# Altium schematic sheet zero cross lm358.SchDoc
size A
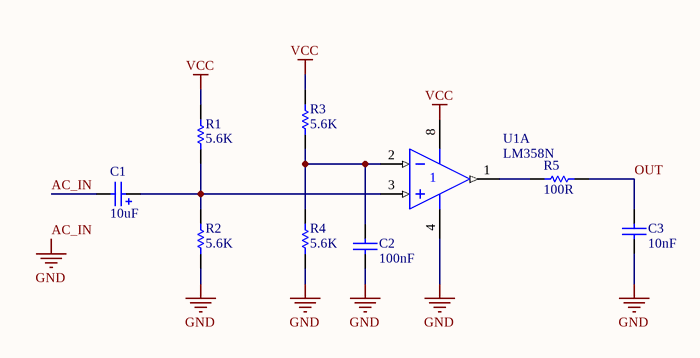
[diagram p0: zero cross lm358.SchDoc]

## Parts
C1  value 10uF  [cap_elec_100]  (hidden comment: Cap Pol)
C2  value 100nF  [cap_104]  (hidden comment: Cap)
C3  value 10nF  [cap_104 - 200]  (hidden comment: capacitor polyester)
R1  value 5.6K  [resistor_1/4_11m]  (hidden comment: resistor)
R2  value 5.6K  [resistor_1/4_11m]  (hidden comment: resistor)
R3  value 5.6K  [resistor_1/4_11m]  (hidden comment: resistor)
R4  value 5.6K  [resistor_1/4_11m]  (hidden comment: resistor)
R5  value 100R  [resistor_1/4_11m]  (hidden comment: resistor)
U1  LM358N  [626-05]  (part A of 2)

## Nets
AC_IN: C1.2 C2.1 C3.1 R2.1 R4.1 U1.4(V-)  [also labelled GND]
VCC: R1.2 R3.2 U1.8(V+)
OUT: C3.2 R5.1
NetC1_1: C1.1 R1.1 R2.2 U1.3(IN+)
NetC2_2: C2.2 R3.1 R4.2 U1.2(IN-)
NetR5_2: R5.2 U1.1(OUT)

## Library data of the parts
C1 = Cap Pol1: Polarized Capacitor (Radial); Published: 8-Jun-2000; LatestRevisionDate: 17-Jul-2002; LatestRevisionNote: Re-released for DXP Platform.; PackageReference: RB7.6-15; Publisher: Altium Limited
C2 C3 = Cap: Capacitor; Published: 8-Jun-2000; LatestRevisionDate: 17-Jul-2002; LatestRevisionNote: Re-released for DXP Platform.; PackageReference: RAD-0.3; Publisher: Altium Limited
R1-R5 = Res1_1/4: Published: 8-Jun-2000; LatestRevisionDate: 17-Jul-2002; LatestRevisionNote: Re-released for DXP Platform.; PackageReference: AXIAL-0.3; Publisher: Altium Limited
U1 = LM358N: Dual Low-Power Operational Amplifier; Published: 17-Jul-2002; LatestRevisionDate: 06-Jun-2005; LatestRevisionNote: Stylized 3D Model Added.; DatasheetVersion: 1988; PackageReference: 626-05; Publisher: Altium Limited; PackageDescription: DIP; 8 Leads; Row Spacing 7.62 mm; Pitch 2.54 mm; ComponentLink1Description: Manufacturer Link; ComponentLink1URL: http://www.onsemi.com/site/products/parametrics/0,4446,251,00.html; ComponentLink2Description: Datasheet; ComponentLink2URL: http://www.onsemi.com/pub/Collateral/LM358-D.PDF